# EAGLE design m0_livewell (EAGLE 8.5.1)
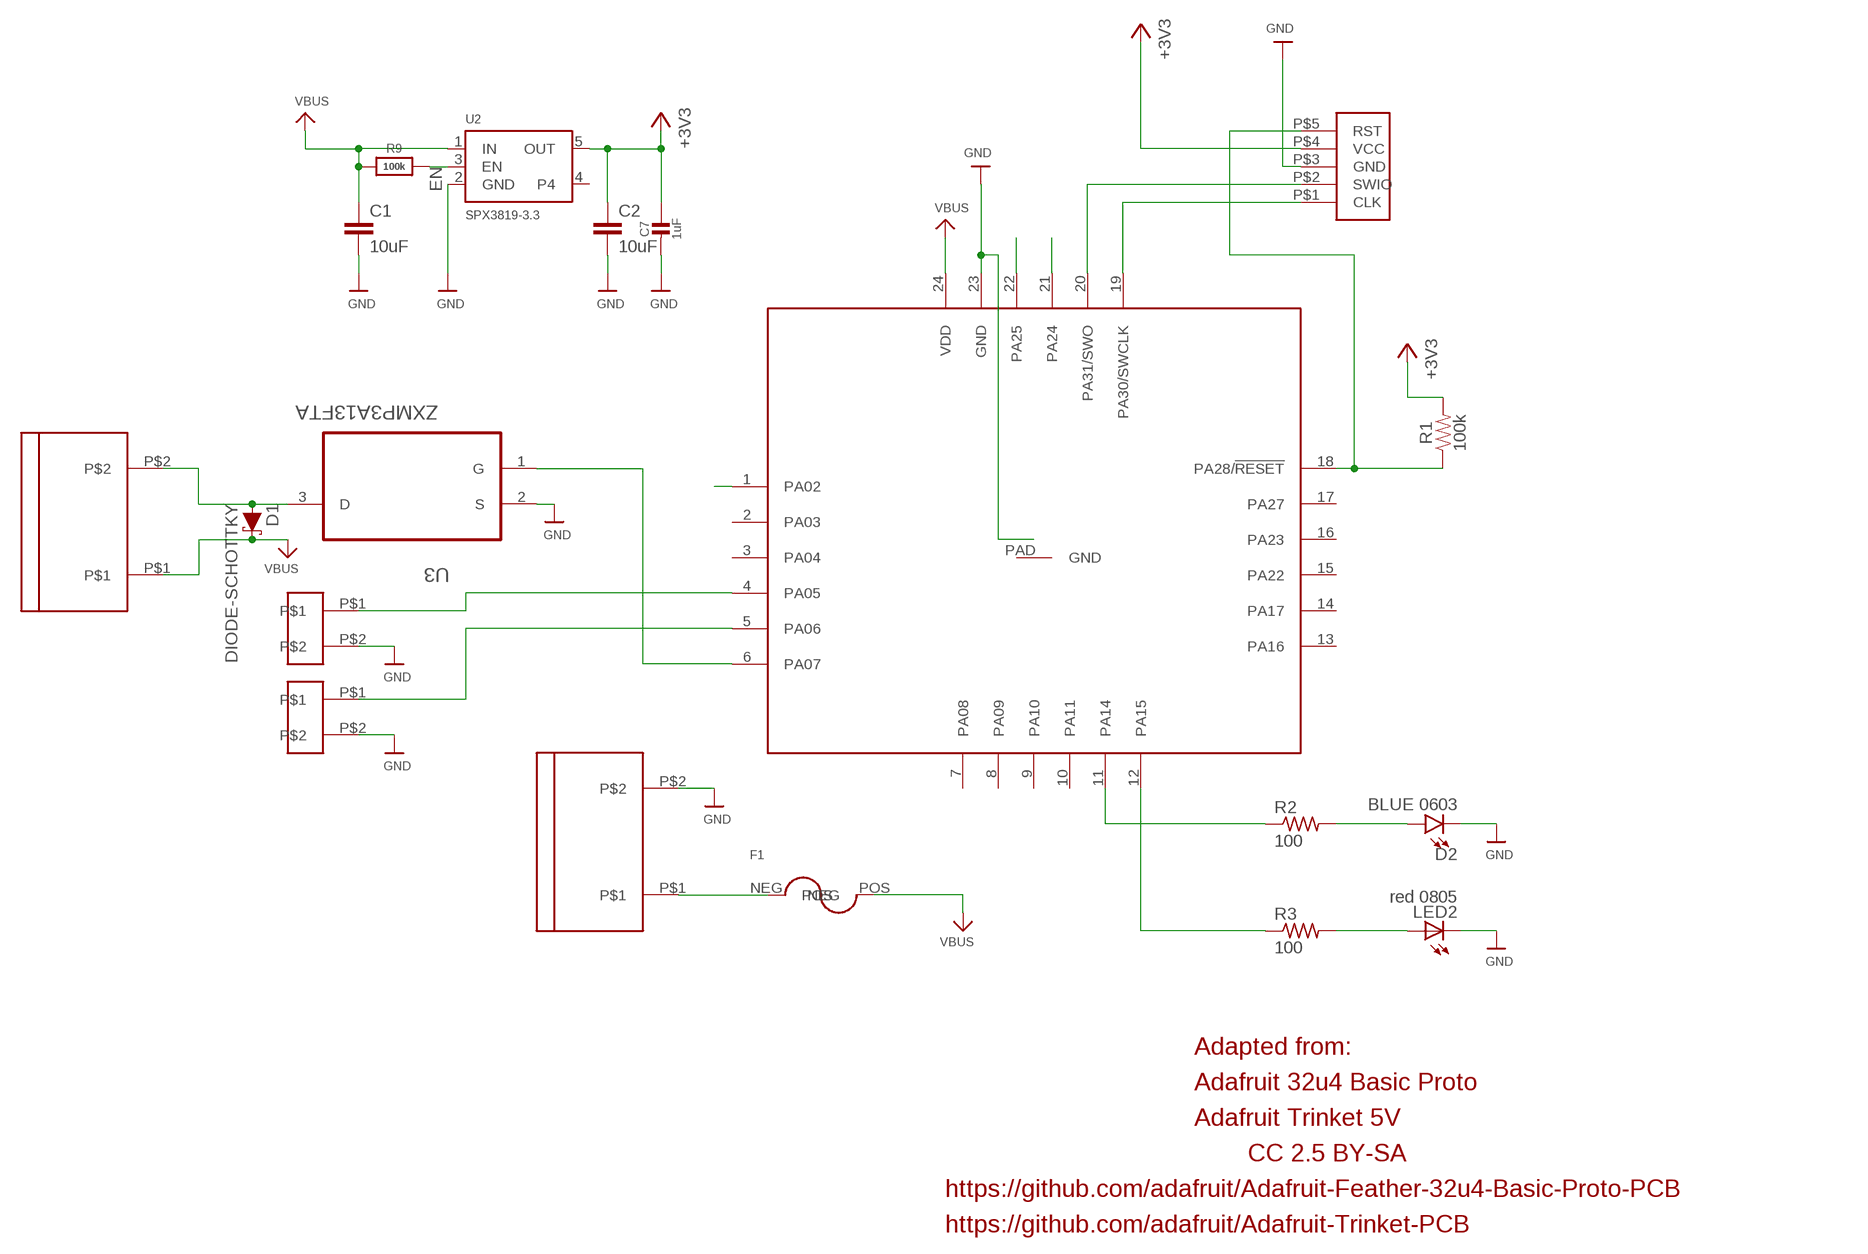
[diagram p0: schematic, sheet 1]

## Parts
C1  10uF  10UF-0603-6.3V-20%  [0603]
C2  10uF  10UF-0603-6.3V-20%  [0603]
C7  1uF  CAP_CERAMIC0603_NO  [0603-NO]
D1  DIODE-SCHOTTKY  [VISHAY_CLP1608-2L]
D2  BLUE 0603  LED-BLUE0603  [LED-0603]
F1  TINYFUSE_0154003.DR  [TINYFUSE_0154003.DR]
LED2  red 0805  LEDCHIPLED_0805  [CHIPLED_0805]
R1  100k  100KOHM-0603-1/10W-1%  [0603]
R2  100  R-US_R0603  [R0603]
R3  100  R-US_R0603  [R0603]
R9  100k  RESISTOR_0603_NOOUT  [0603-NO]
U2  SPX3819-3.3  VREG_SOT23-5  [SOT23-5]
U3  ZXMP3A13FTA  [SOT95P237X112-3N]
U$1  SAMD11D14A-MSAMD11D14A-M  [QFN24]
U$13  SCREWTERM  [SCREWTERM]
U$14  SCREWTERM  [SCREWTERM]
U$15  WP_BUTTON  [WATERPROOF_BUTTON]
U$16  WP_BUTTON  [WATERPROOF_BUTTON]
U$17  CASTILLATED_SWDIO  [SWD_CASTILLATED]

## Nets
+3V3: C2.1 C7.1 R1.2 U2.5(OUT) U$1.24(VDD) U$17.P$4(VCC) ; supply symbol labelled VBUS
+14V: C1.1 D1.P$1(C) F1.POS(NEG) R9.1 U2.1(IN) U$13.P$1 ; supply symbol labelled VBUS
BTN1: U$1.5(PA06) U$16.P$1
BTN2: U$1.4(PA05) U$15.P$1
EN: R9.2 U2.3(EN)
GND: C1.2 C2.2 C7.2 D2.C LED2.C U2.2(GND) U3.2(S) U$1.23(GND) U$14.P$2 U$15.P$2 U$16.P$2 U$17.P$3(GND)
N$1: F1.NEG(POS) U$14.P$1
N$2: R1.1 U$1.18(PA28/!RESET) U$17.P$5(RST)
N$3: D2.A R2.2
N$4: LED2.A R3.2
N$5: R2.1 U$1.11(PA14)
N$6: R3.1 U$1.12(PA15)
N$7: U$1.1(PA02)
PWM: U3.1(G) U$1.6(PA07)
PWM_OUT: D1.P$2(A) U3.3(D) U$13.P$2
SWCLK: U$1.19(PA30/SWCLK) U$17.P$1(CLK)
SWDIO: U$1.20(PA31/SWO) U$17.P$2(SWIO)
USB_DM: U$1.21(PA24)
USB_DP: U$1.22(PA25)
Unconnected: U2.4 U$1.2(PA03) U$1.3(PA04) U$1.7(PA08) U$1.8(PA09) U$1.9(PA10) U$1.10(PA11) U$1.13(PA16) U$1.14(PA17) U$1.15(PA22) U$1.16(PA23) U$1.17(PA27) U$1.PAD(GND)

## Notes on the sheet
- Adapted from:
- Adafruit 32u4 Basic Proto
- Adafruit Trinket 5V
- CC 2.5 BY-SA
- https://github.com/adafruit/Adafruit-Feather-32u4-Basic-Proto-PCB
- https://github.com/adafruit/Adafruit-Trinket-PCB

## Library data of the parts
C1 C2 = SparkFun-Capacitors:10UF: 10.0µF ceramic capacitors A capacitor is a passive two-terminal electrical component used to store electrical energy temporarily in an electric field.; PROD_ID: CAP-11015
C7 = microbuilder:CAP_CERAMIC: Ceramic Capacitors For new designs, use the packages preceded by an '_' character since they are more reliable: The following footprints should be used on most boards: _0402 - Standard footprint for regular board layouts _0603 - Standard footprint for regular board layouts _0805 - Standard footprint for regular board layouts _1206 - Standard footprint for regular board layouts For extremely tight-pitch boards where space is at a premium, the following 'micro-pitch' footprints can be used (smaller pads, no silkscreen outline, etc.): _0402MP - Micro-pitch footprint for very dense/compact boards _0603MP - Micro-pitch footprint for very dense/compact boards _0805MP - Micro-pitch footprint for very dense/compact boards _1206MP - Micro-pitch footprint for very dense/compact boards
D1 = 00_bsiepert:DIODE-SCHOTTKY: Schottky diode A Schottky diode is a semiconductor diode which has a low forward voltage drop and a very fast switching action.
D2 = SparkFun-LED:LED-BLUE: Blue SMD LED Used in manufacturing of various products at SparkFun Packages: 0603 - SMD 0603 package [Product Link] <http://www.digikey.com/product-detail/en/SMLE12BC7TT86/511-1589-2-ND/1641808> 1206 - SMD1206 package [Product Link] <http://www.digikey.com/product-detail/en/lite-on-inc/LTST-C150TBKT/160-1643-1-ND/573584> SparkFun Products: ESP8266 Thing-Dev Board <https://www.sparkfun.com/products/13711> RedBoard <https://www.sparkfun.com/products/12757>; PROD_ID: DIO-08575; VALUE: BLUE
F1 = 00_bsiepert:TINYFUSE_0154003.DR: This is a small ass fuse Datasheet: MOUSER <http://www.mouser.com/ds/2/240/Littelfuse_Fuse_154_154T_154L_154TL_Datasheet.pdf-309941.pdf>
LED2 = adafruit:LED: LED OSRAM: - CHIPLED LG R971, LG N971, LY N971, LG Q971, LY Q971, LO R971, LY R971 LH N974, LH R974 LS Q976, LO Q976, LY Q976 LO Q996 - Hyper CHIPLED LW Q18S LB Q993, LB Q99A, LB R99A - SideLED LS A670, LO A670, LY A670, LG A670, LP A670 LB A673, LV A673, LT A673, LW A673 LH A674 LY A675 LS A676, LA A676, LO A676, LY A676, LW A676 LS A679, LY A679, LG A679 - Hyper Micro SIDELED® LS Y876, LA Y876, LO Y876, LY Y876 LT Y87S - SmartLED LW L88C, LW L88S LB L89C, LB L89S, LG L890 LS L89K, LO L89K, LY L89K LS L896, LA L896, LO L896, LY L896 - TOPLED LS T670, LO T670, LY T670, LG T670, LP T670 LSG T670, LSP T670, LSY T670, LOP T670, LYG T670 LG T671, LOG T671, LSG T671 LB T673, LV T673, LT T673, LW T673 LH T674 LS T676, LA T676, LO T676, LY T676, LB T676, LH T676, LSB T676, LW T676 LB T67C, LV T67C, LT T67C, LS T67K, LO T67K, LY T67K, LW E67C LS E67B, LA E67B, LO E67B, LY E67B, LB E67C, LV E67C, LT E67C LW T67C LS T679, LY T679, LG T679 LS T770, LO T770, LY T770, LG T770, LP T770 LB T773, LV T773, LT T773, LW T773 LH T774 LS E675, LA E675, LY E675, LS T675 LS T776, LA T776, LO T776, LY T776, LB T776 LHGB T686 LT T68C, LB T68C - Hyper Mini TOPLED® LB M676 - Mini TOPLED Santana® LG M470 LS M47K, LO M47K, LY M47K Source: http://www.osram.convergy.de/
R1 = SparkFun-Resistors:100KOHM: 100kΩ resistor A resistor is a passive two-terminal electrical component that implements electrical resistance as a circuit element. Resistors act to reduce current flow, and, at the same time, act to lower voltage levels within circuits. - Wikipedia; PROD_ID: RES-07828
R2 R3 = adafruit:R-US_: RESISTOR, American symbol
R9 = microbuilder:RESISTOR: Resistors For new designs, use the packages preceded by an '_' character since they are more reliable: The following footprints should be used on most boards: _0402 - Standard footprint for regular board layouts _0603 - Standard footprint for regular board layouts _0805 - Standard footprint for regular board layouts _1206 - Standard footprint for regular board layouts For extremely tight-pitch boards where space is at a premium, the following 'micro-pitch' footprints can be used (smaller pads, no silkscreen outline, etc.): _0402MP - Micro-pitch footprint for very dense/compact boards _0603MP - Micro-pitch footprint for very dense/compact boards _0805MP - Micro-pitch footprint for very dense/compact boards _1206MP - Micro-pitch footprint for very dense/compact boards
U2 = microbuilder:VREG_SOT23-5: SOT23-5 Fixed Voltage Regulators Part Current Out V Out V In V Dropout θJA (°C/W) TJ (°C) Digikey Part No. ADP121 150mA 3.3V 3.4-5.5V 0.09V @ 150mA -- -- ADP121-AUJZ33R7CT-ND ADP121 150mA 3.0V 3.1-5.5V 0.09V @ 150mA -- -- ADP121-AUJZ30R7CT-ND ADP122 300mA 3.3V 3.4-5.5V 0.085V @ 300mA -- -- ADP122AUJZ-3.3-R7CT-ND ADP1712 300mA 3.3V 3.5-5.5V 0.17V @ 300mA -- -- ADP1712AUJZ-3.3-R7TR-ND AP7311 (Low Cost) 150mA 3.3V 3.5-6V 0.15V @ 150mA -- -- AP7311-33WG-7DICT-ND LD39015M18R 150mA 1.8V 1.9V-5.5V 0.08V @ 100mA -- -- 497-6977-1-ND LP2985A-33DBVR 150mA 3.3V 3.3-16V 0.28V @ 150mA 206 150 296-18479-1-ND MCP1824T-3302E/OT 300mA 3.3V 3.5V-6V 0.2V @ 300mA -- -- MCP1824T-3302E/OTCT-ND MIC5205-2.5YM5 TR 150mA 2.5V 2.7-16V 0.165V @ 150mA -- -- 576-1257-2-ND MIC5205-3.0YM5 TR 150mA 3.0V 3.2V-16V 0.165V @ 150mA -- -- 576-1258-2-ND MIC5205-3.3YM5 TR 150mA 3.3V 3.5V-16V 0.165V @ 150mA -- -- 576-1259-2-ND TPS780330220 150mA 3.3V+2.2V 3.6-5.5V 250mV Max -- -- 296-23332-1-ND TDA3663/N1,135 100mA 3.3V 3.5-45V 0.18V @ 50mA -- -- 568-5343-1-ND Max operating temp can be calculated using θJA, TJ (max junction temperature), and power in watts. Set the "Maximum Ambient Temperature" until it reaches TJ ("Max Junction Temperature"), which is the absolute limit for safe use of the regulator: Heat Sink Temperature Calculator <http://www.daycounter.com/Calculators/Heat-Sink-Temperature-Calculator.phtml> For example, With 12V source into a 3.3V LP2985 and a 30mA load, we are dissipating (12V-3.3V) * 0.03A = 0.261W. With a θJA of 206 °C/W, a TJ of 150°C, and 261mW we can safely use the chip without a heat sink up to 75°C (=147.1°C Junction Temperature).
U3 = Diodes_Inc_By_element14_Batch_1:ZXMP3A13FTA: 30V P-CHANNEL ENHANCEMENT MODE MOSFET; MPN: ZXMP3A13FTA; OC_FARNELL: 7564937; OC_NEWARK: 38K9599; PACKAGE: SOT-23-3; SUPPLIER: Diodes Inc
U$1 = 00_bsiepert:SAMD11D14A-M
U$13 U$14 = 00_bsiepert:SCREWTERM
U$15 U$16 = 00_bsiepert:WP_BUTTON
U$17 = 00_bsiepert:CASTILLATED_SWDIO

## Net classes
1 power: width 0.305 mm

## Board
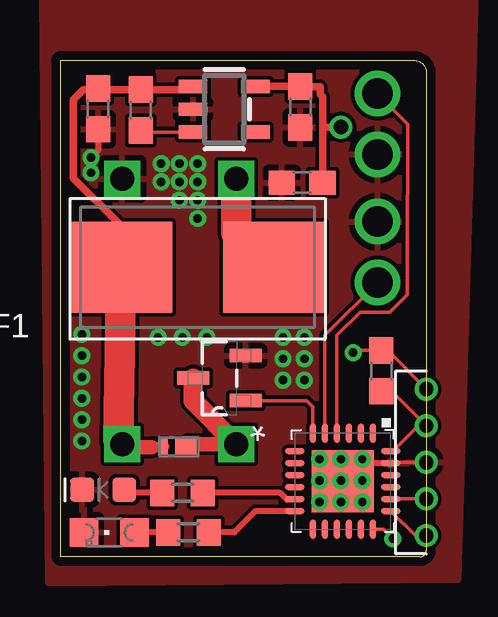
[diagram p1: board, top side]
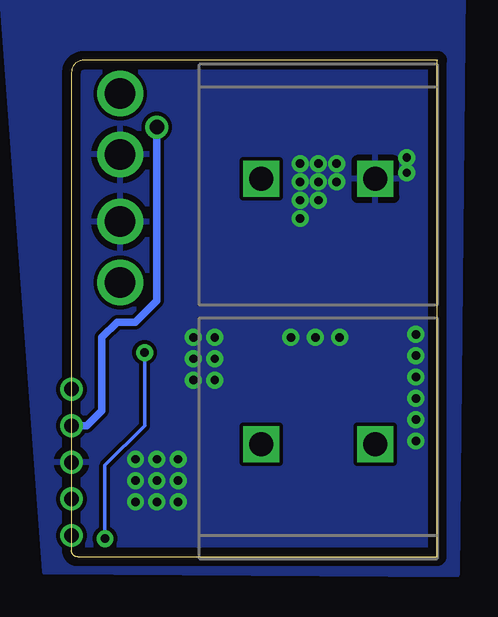
[diagram p2: board, bottom side, seen from below]

Size 15.26 x 20.7 mm. Coordinates in mm from the lower left corner, seen from the top.
Outline: 0.02,20.7 0.02,0 15.01,0 arc90 15.26,0.25 15.26,20.19 arc90 14.76,20.68 0,20.68
Copper layers (1*16): Top 0.0356mm / dielectric 1.5011mm / Bottom 0.0356mm
Design rules "oshpark-2layer *": minimum track width 6mil, minimum drill 13mil, track to track 6mil, track to pad 6mil, pad to pad 6mil, via to via 6mil, smd to smd 6mil, copper to edge 15mil, drill to drill 6mil, minimum pad ring 7mil, minimum via ring 7mil, stop-mask expansion 2.5mil, vias tented up to drill 30mil, thermal gap 10mil

### Footprints (pad centres in the part's own frame; a part is rotated, then mirrored left to right if it is on the bottom)
0603 = smd 1.1 x 1: 1 -0.85,0; 2 0.85,0
0603-NO = smd 1.1 x 1: 1 -0.85,0; 2 0.85,0
VISHAY_CLP1608-2L = smd 0.28 x 0.62: P$1 -0.595,0 | smd 0.88 x 0.62: P$2 0.295,0
LED-0603 = smd 1 x 1: A -0.877,0; C 0.877,0
TINYFUSE_0154003.DR = smd 4.242 x 3.81: NEG -3.188,0; POS 3.188,0
CHIPLED_0805 = smd 1.2 x 1.2: A 0,-1.05; C 0,1.05
R0603 = smd 1 x 1.1: 1 -0.85,0; 2 0.85,0
SOT23-5 = smd 0.55 x 1.2: 1 -0.95,-1.3; 2 0,-1.3; 3 0.95,-1.3; 4 0.95,1.3; 5 -0.95,1.3
SOT95P237X112-3N = smd 1.321 x 0.559: 1 -1.092,0.94; 2 -1.092,-0.94; 3 1.092,0
QFN24 = smd 0.8 x 0.25: 1 -2,1.25; 2 -2,0.75; 3 -2,0.25; 4 -2,-0.25; 5 -2,-0.75; 6 -2,-1.25; 13 2,-1.25; 14 2,-0.75; 15 2,-0.25; 16 2,0.25; 17 2,0.75; 18 2,1.25 | smd 0.25 x 0.8: 7 -1.25,-2; 8 -0.75,-2; 9 -0.25,-2; 10 0.25,-2; 11 0.75,-2; 12 1.25,-2; 19 1.25,2; 20 0.75,2; 21 0.25,2; 22 -0.25,2; 23 -0.75,2; 24 -1.25,2 | smd 2.6 x 2.6: PAD 0,0
SCREWTERM = drill 1 square: P$1 2.375,0; P$2 -2.375,0
WATERPROOF_BUTTON = drill 1.27: P$1 -1.27,0; P$2 1.27,0
SWD_CASTILLATED = drill 0.6: P$1 -3.048,0; P$2 -1.524,0; P$3 0,0; P$4 1.524,0; P$5 3.048,0

### Placement (x,y rotation side)
C1  1.58,18.66 270 top
C2  10.09,15.6 180 top
C7  10.02,18.74 270 top
D1  4.95,4.59 0 top
D2  1.8,2.79 180 top
F1  5.74,12.06 180 top
LED2  2.05,1.02 90 top
R1  13.38,7.75 270 top
R2  5.1,2.67 180 top
R3  5.36,1.02 180 top
R9  3.36,18.61 270 top
U2  6.84,18.65 270 top
U3  6.65,7.45 180 top
U$1  11.78,3.15 270 top
U$13  4.97,4.7 0 bottom
U$14  4.97,15.75 180 bottom
U$15  13.23,18.03 270 top
U$16  13.23,12.7 90 top
U$17  15.26,3.94 90 top

### Tracks (layer width: path | path; a pad name or v marks a point on that pad's centre or on a via)
+3V3  (via drill 0.6)
  Top 0.152: U$1.24 13.87,4.4 14.93,5.46 U$17.P$4 13.83,6.9 R1.2 | 8.28,19.46 U2.5
  Top 0.305: 10.94,17.91 10.94,18.92 10.94,19.18 10.85,19.27 10.85,19.59 C7.1 U2.5 | 10.94,17.91 C2.1 | 10.94,17.91 v11.71,17.91
  Bottom 0.305: v11.71,17.91 11.71,10.67 12.59,9.78 13.36,9.78 13.99,9.14 13.99,6.1 14.63,5.46 U$17.P$4
+14V
  Top 0.152: U2.1 5.41,19.46 | 1.64,19.46 C1.1
  Top 0.305: 5.41,19.46 R9.1 1.64,19.46 0.97,19.46 0.55,19.05 0.55,15.78 2.42,13.91 F1.POS
  Top 0.406: 3.83,4.57 3.85,4.59 D1.P$1
  Top 0.61: U$13.P$1 2.73,4.57 3.83,4.57
  Top 1.27: F1.POS 2.42,4.88 U$13.P$1
BTN1
  Top 0.152: U$1.5 11.03,9.23 U$16.P$1
BTN2
  Top 0.152: U$1.4 11.53,9.23 12.5,10.2 13.74,10.2 14.46,10.92 14.46,15.07 14.5,15.11 14.5,18.03 U$15.P$1
EN
  Top 0.152: U2.3 3.42,17.7 R9.2
GND  (via drill 0.35)
  Top 0.152: U$17.P$3 13.82,3.94 U$1.23
  Top 0.254: U$1.23 12.76,3.9 v12.59,4.06 | C1.2 1.58,16.93 v1.29,16.64
  other vias: 0.91,9.27 0.91,8.38 0.91,7.49 0.91,6.6 0.91,5.71 0.91,4.83 4.09,9.14 5.1,9.14 6.12,9.14 9.29,9.14 10.18,9.14 9.29,8.26 10.18,8.26 10.18,7.37 9.29,7.37 10.82,4.06 11.71,4.06 10.82,3.17 11.71,3.17 12.59,3.17 10.82,2.29 11.71,2.29 12.59,2.29 4.21,16.38 4.97,16.38 5.74,16.38 5.74,15.62 4.97,15.62 4.21,15.62 4.97,14.86 5.74,14.86 5.74,14.1 1.29,16
  pour Bottom: -1.04,23.66 -0.79,-0.75 16.36,-0.63 18.24,24.57
  pour Top: -0.76,23.33 -0.51,-1.1 16.61,-0.95 17.35,23.63
N$1
  Top 1.27: U$14.P$1 7.35,13.51 F1.NEG
N$2  (via drill 0.35)
  Top 0.152: U$17.P$5 13.65,8.6 R1.1 12.3,8.6 v12.21,8.51 | U$1.18 13.48,1.15 v13.86,0.76
  Bottom 0.152: v13.86,0.76 13.86,3.81 12.21,5.46 v12.21,8.51
N$3
  Top 0.152: 2.8,2.67 D2.A
  Top 0.254: R2.2 2.8,2.67
N$4
  Top 0.254: R3.2 LED2.A
N$5
  Top 0.254: R2.1 9.17,2.67 9.47,2.37 9.5,2.4 U$1.11
N$6
  Top 0.254: U$1.12 8.14,1.9 7.26,1.02 R3.1
PWM
  Top 0.152: U$1.6 10.53,6.25 10.28,6.51 U3.1
PWM_OUT
  Top 0.61: U$13.P$2 5.35,4.7 D1.P$2
  Top 0.813: U3.3 5.55,6.5 U$13.P$2
SWCLK
  Top 0.152: U$17.P$1 14.79,0.89 U$1.19
SWDIO
  Top 0.152: U$17.P$2 13.8,2.41 U$1.20